# EAGLE design keyboard (EAGLE 9.6.2)
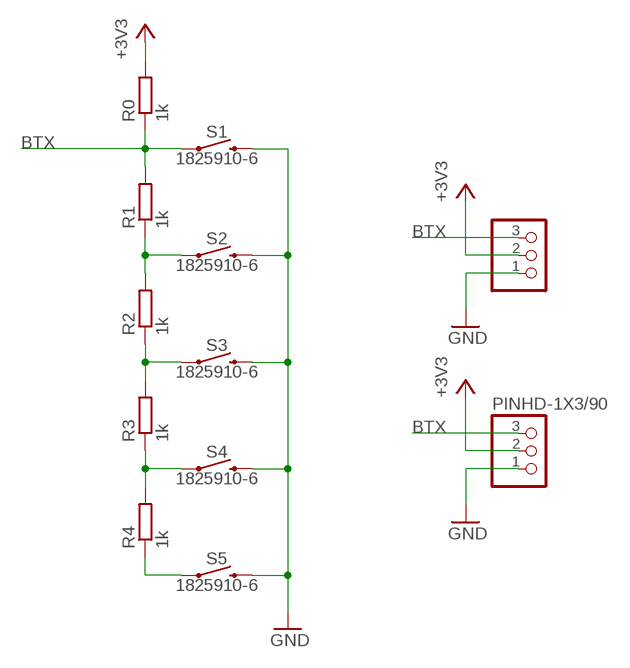
[diagram p0: schematic, sheet 1]

## Parts
JP1  PINHD-1X3/90  [1X03/90]
JP2  PINHD-1X3/90  [1X03/90]
R0  1k  R-EU_R1206  [R1206]
R1  1k  R-EU_R1206  [R1206]
R2  1k  R-EU_R1206  [R1206]
R3  1k  R-EU_R1206  [R1206]
R4  1k  R-EU_R1206  [R1206]
S1  1825910-6  [1825910-6]
S2  1825910-6  [1825910-6]
S3  1825910-6  [1825910-6]
S4  1825910-6  [1825910-6]
S5  1825910-6  [1825910-6]

## Nets
+3V3: JP1.2 JP2.2 R0.2
BTX: JP1.3 JP2.3 R0.1 R1.2 S1.1 S1.3
GND: JP1.1 JP2.1 S1.2 S1.4 S2.2 S2.4 S3.2 S3.4 S4.2 S4.4 S5.2 S5.4
N$2: R4.1 S5.1 S5.3
N$3: R1.1 R2.2 S2.1 S2.3
N$4: R2.1 R3.2 S3.1 S3.3
N$5: R3.1 R4.2 S4.1 S4.3

## Library data of the parts
JP1 = Connector:PINHD-1X3: PIN HEADER; CATEGORY: CONNECTOR; SPICEPREFIX: J; SUB-CATEGORY: PIN-HEADER
JP2 = Connector:PINHD-1X3: PIN HEADER; CATEGORY: CONNECTOR; SUB-CATEGORY: PIN-HEADER
R0 R1-R4 = resistor:R-EU_: RESISTOR, European symbol
S1-S5 = omez-packs:1825910-6: SWITCH TACTILE SPST-NO 0.05A 24V Manufacturer's datasheet <https://www.te.com/commerce/DocumentDelivery/DDEController?Action=srchrtrv&DocNm=1825910&DocType=Customer+Drawing&DocLang=English>; CREATED_BY: PCBLayout.com; DIGIKEY_PART_NUMBER: 450-1650-ND; MANUFACTURER: TE Connectivity ALCOSWITCH Switches; MPN: 1825910-6

## Board
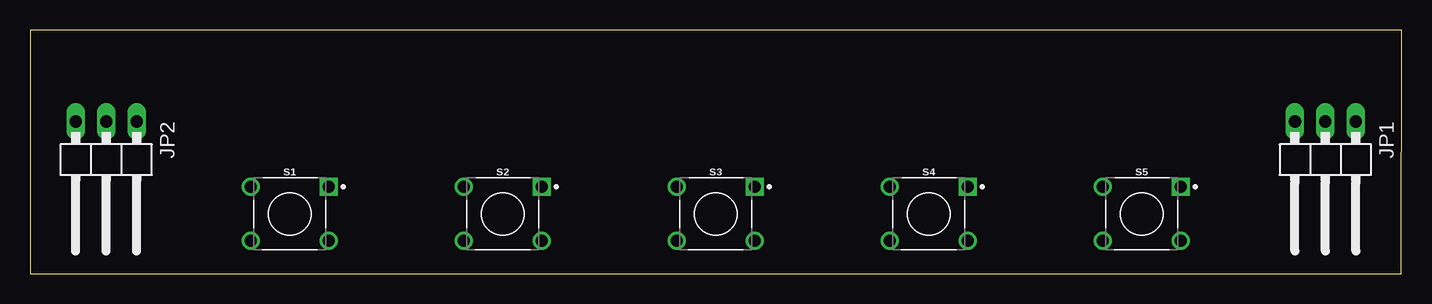
[diagram p1: board, top side]
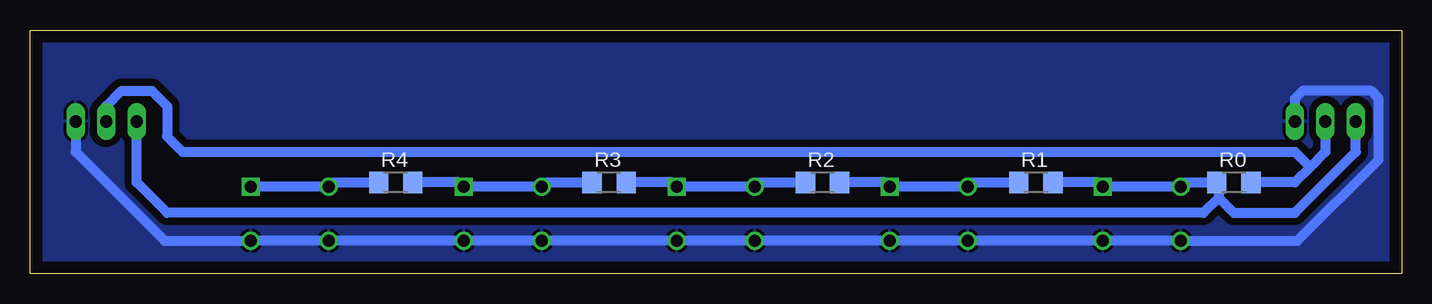
[diagram p2: board, bottom side, seen from below]

Size 114.3 x 20.32 mm. Coordinates in mm from the lower left corner, seen from the top.
Outline: 0,20.32 0,0 114.28,0 114.3,20.32 0,20.32
Copper layers (1*16): Top 0.035mm / dielectric 1.5mm / Bottom 0.035mm
Design rules "default *": minimum track width 6mil, minimum drill 0.35mm, track to track 6mil, track to pad 6mil, pad to pad 6mil, via to via 6mil, smd to smd 6mil, copper to edge 40mil, drill to drill 6mil, minimum pad ring 10mil, minimum via ring 8mil, stop-mask expansion 4mil, vias tented up to drill 0mil, thermal gap 10mil

### Footprints (pad centres in the part's own frame; a part is rotated, then mirrored left to right if it is on the bottom)
1X03/90 = drill 1.016 long: 1 -2.54,-3.81; 2 0,-3.81; 3 2.54,-3.81
R1206 = smd 1.6 x 1.803: 1 -1.422,0; 2 1.422,0
1825910-6 = drill 0.99 square: 1 3.25,2.25 | drill 0.99: 2 3.25,-2.25; 3 -3.25,2.25; 4 -3.25,-2.25

### Placement (x,y rotation side)
JP1  107.95,8.89 180 top
JP2  6.35,8.89 180 top
R0  13.97,7.62 0 bottom
R1  30.48,7.62 0 bottom
R2  48.26,7.62 0 bottom
R3  66.04,7.62 0 bottom
R4  83.82,7.62 0 bottom
S1  21.65,5 0 top
S2  39.4,5 0 top
S3  57.15,5 0 top
S4  74.9,5 0 top
S5  92.65,5 0 top

### Tracks (layer width: path | path; a pad name or v marks a point on that pad's centre or on a via)
+3V3
  Bottom 0.813: JP2.2 6.35,10.16 7.62,8.89 | 7.62,8.89 8.89,7.62 R0.2 | JP1.2 107.95,13.97 106.68,15.24 104.14,15.24 102.87,13.97 102.87,11.43 101.6,10.16 8.89,10.16 7.62,8.89
BTX
  Bottom 0.813: R1.2 25.27,7.62 S1.1 S1.3 18.03,7.62 R0.1 15.24,7.47 15.24,6.35 | 15.24,6.35 13.97,5.08 8.89,5.08 3.81,10.16 JP2.3 | 15.24,6.35 16.51,5.08 102.87,5.08 105.41,7.62 JP1.3
GND
  Bottom 0.813: JP2.1 8.89,14.61 8.25,15.24 2.54,15.24 1.91,14.61 1.91,9.53 8.68,2.75 S1.4 S1.2 S2.4 S2.2 S3.4 S3.2 S4.4 S4.2 S5.4 S5.2 103.08,2.75 110.49,10.16 JP1.1
  pour Bottom (isolate 0.61): 0,20.32 114.3,20.32 114.3,0 0,0
N$2
  Bottom 0.813: S5.1 S5.3 89.03,7.62 R4.1
N$3
  Bottom 0.813: R1.1 35.78,7.62 S2.3 S2.1 43.02,7.62 R2.2
N$4
  Bottom 0.813: R2.1 53.53,7.62 S3.3 S3.1 60.77,7.62 R3.2
N$5
  Bottom 0.813: R3.1 71.28,7.62 S4.3 S4.1 78.52,7.62 R4.2